# EAGLE design Dual v12 (EAGLE 6.5.0)

## Sheet 1 of 2
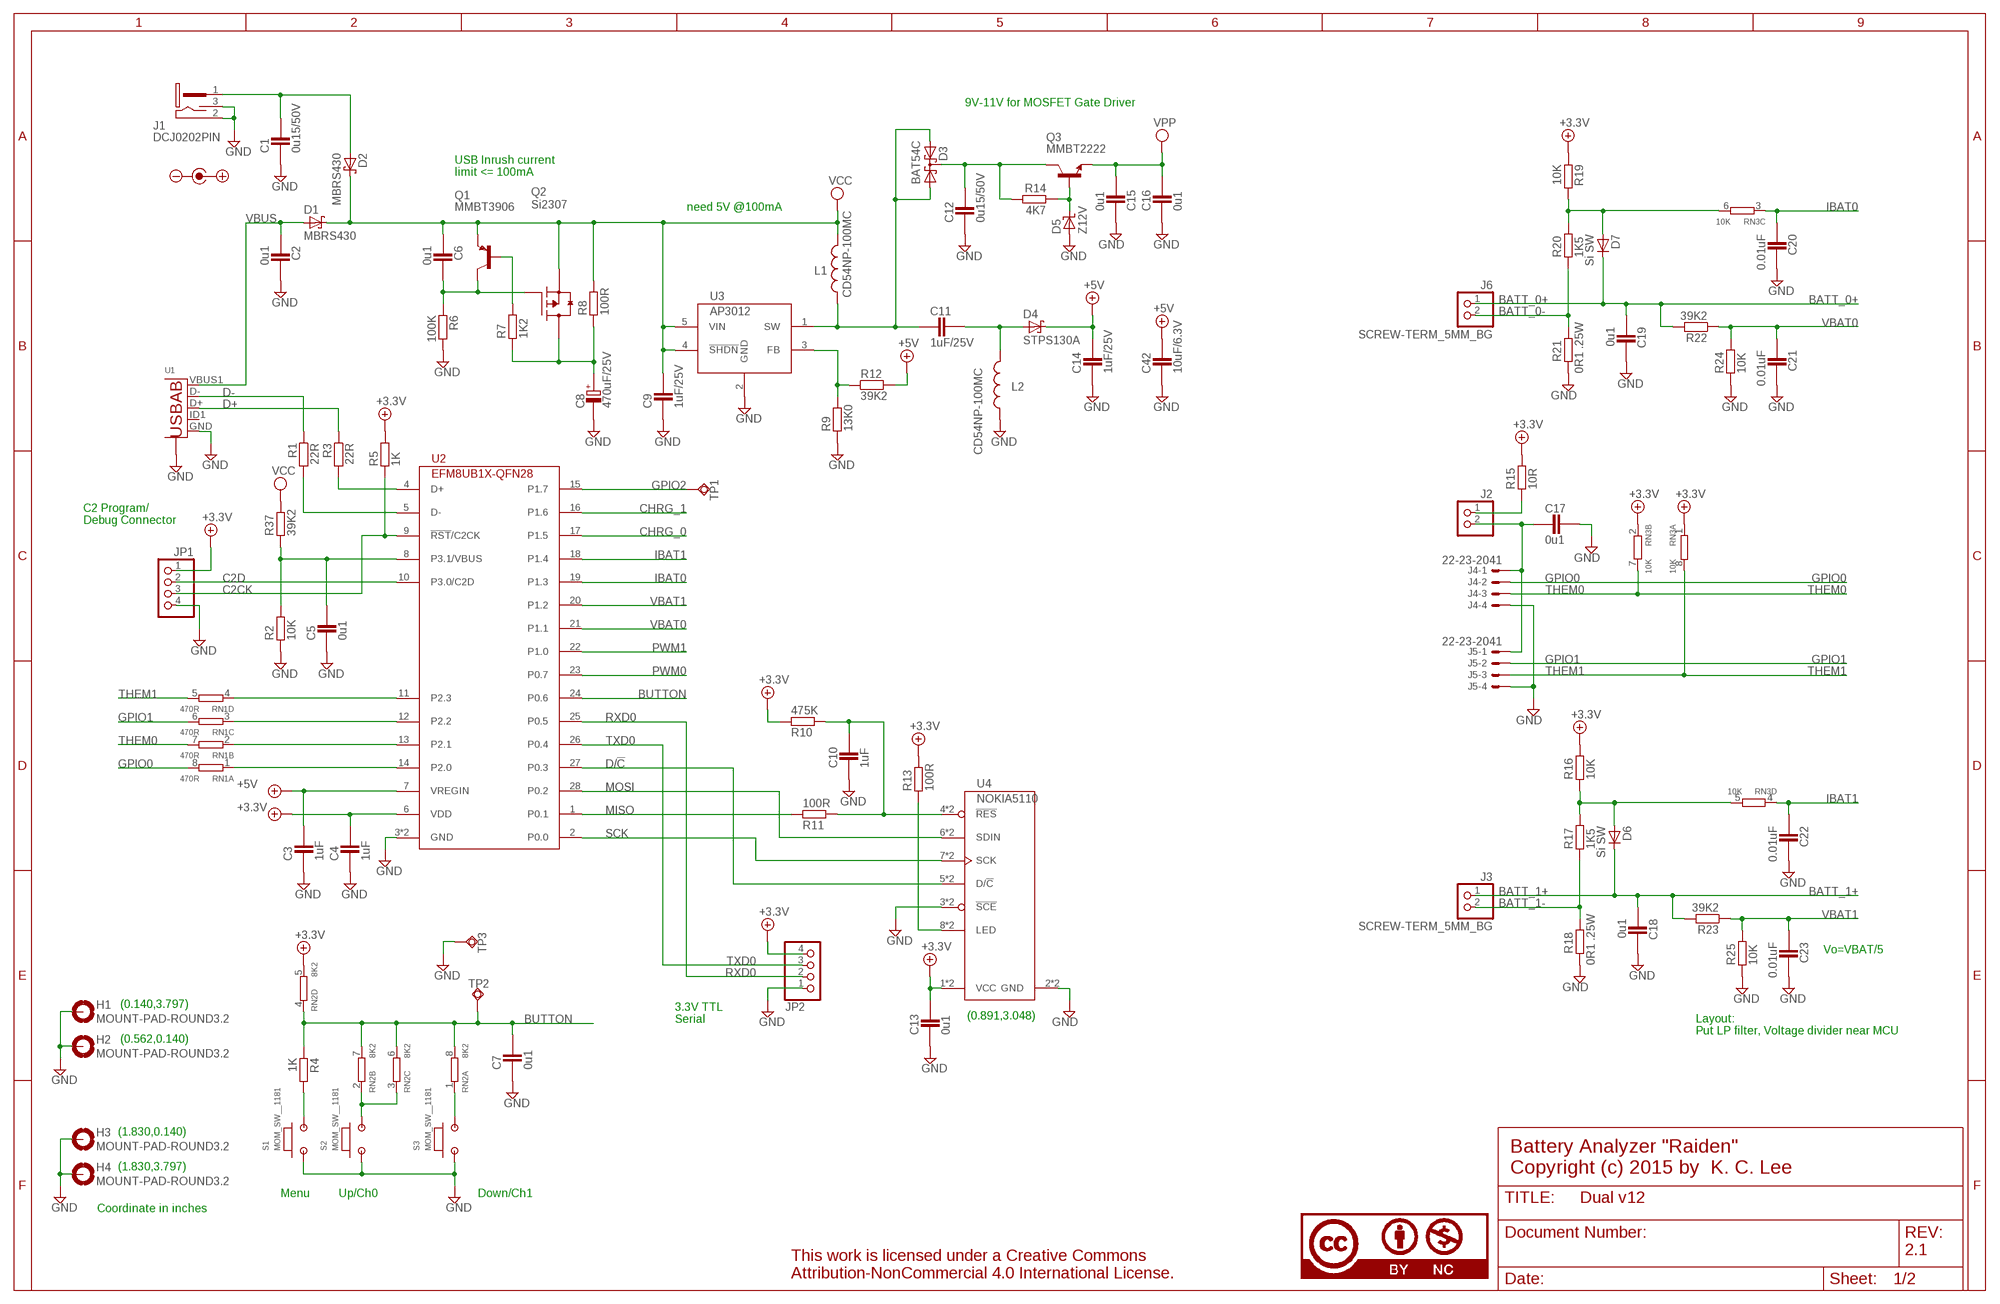
[diagram p0: schematic, sheet 1]

### Parts
C1  0u15/50V  CAPACITOR_0805N  [CAP2012X70N]
C2  0u1  CAPACITOR_0603  [CAPC1608X92N]
C3  1uF  CAPACITOR_0402  [CAPC1005X60N]
C4  1uF  CAPACITOR_0402  [CAPC1005X60N]
C5  0u1  CAPACITOR_0402  [CAPC1005X60N]
C6  0u1  CAPACITOR_0603  [CAPC1608X92N]
C7  0u1  CAPACITOR_0603  [CAPC1608X92N]
C8  470uF/25V  POLARISED_CASE_G  [CAPAE1030X1020N]
C9  1uF/25V  CAPACITOR_0805N  [CAP2012X70N]
C10  1uF  CAPACITOR_0603  [CAPC1608X92N]
C11  1uF/25V  CAPACITOR_0805N  [CAP2012X70N]
C12  0u15/50V  CAPACITOR_0805N  [CAP2012X70N]
C13  0u1  CAPACITOR_0603  [CAPC1608X92N]
C14  1uF/25V  CAPACITOR_0805N  [CAP2012X70N]
C15  0u1  CAPACITOR_0603  [CAPC1608X92N]
C16  0u1  CAPACITOR_0603  [CAPC1608X92N]
C17  0u1  CAPACITOR_0603  [CAPC1608X92N]
C18  0u1  CAPACITOR_0603  [CAPC1608X92N]
C19  0u1  CAPACITOR_0603  [CAPC1608X92N]
C20  0.01uF  CAPACITOR_0603  [CAPC1608X92N]
C21  0.01uF  CAPACITOR_0603  [CAPC1608X92N]
C22  0.01uF  CAPACITOR_0603  [CAPC1608X92N]
C23  0.01uF  CAPACITOR_0603  [CAPC1608X92N]
C42  10uF/6.3V  CAPACITOR_0805N  [CAP2012X70N]
D1  MBRS430  SCHOTTKY_SMC  [DIOM7959X265N]
D2  MBRS430  SCHOTTKY_SMC  [DIOM7959X265N]
D3  BAT54C  [SOT95P280X135-3N]
D4  STPS130A  SCHOTTKY_SMA  [DIOM5326X292N]
D5  Z12V  ZENER_SOT-23  [SOT95P280X135-3N]
D6  Si SW  DIODE_SOT-23  [SOT95P280X135-3N]
D7  Si SW  DIODE_SOT-23  [SOT95P280X135-3N]
H1  MOUNT-PAD-ROUND3.2  [3,2-PAD]
H2  MOUNT-PAD-ROUND3.2  [3,2-PAD]
H3  MOUNT-PAD-ROUND3.2  [3,2-PAD]
H4  MOUNT-PAD-ROUND3.2  [3,2-PAD]
J1  DCJ0202PIN  [PJ-102A]
J2  PINHD-1X2_2.54  [1X02]
J3  SCREW-TERM_5MM_BG  [1X02-5MM-BG]
J4  22-23-2041  [22-23-2041]
J5  22-23-2041  [22-23-2041]
J6  SCREW-TERM_5MM_BG  [1X02-5MM-BG]
JP1  PINHD-1X4_2.54  [1X04]
JP2  PINHD-1X4_2.54-90°  [1X04-RA]
L1  CD54NP-100MC  CD54  [CD54]
L2  CD54NP-100MC  CD54  [CD54]
Q1  MMBT3906  PNP_SOT-23  [SOT95P280X135-3N]
Q2  Si2307  MOSFET-PCH_SOT-23  [SOT95P280X135-3N]
Q3  MMBT2222  NPN_SOT-23  [SOT95P280X135-3N]
R1  22R  RESISTOR_0603  [RESC1608X55N]
R2  10K  RESISTOR_0603  [RESC1608X55N]
R3  22R  RESISTOR_0603  [RESC1608X55N]
R4  1K  RESISTOR_0603  [RESC1608X55N]
R5  1K  RESISTOR_0402  [RESC1005X40AN]
R6  100K  RESISTOR_0603  [RESC1608X55N]
R7  1K2  RESISTOR_0603  [RESC1608X55N]
R8  100R  RESISTOR_0805  [RESC2012X70N]
R9  13K0  RESISTOR_0603  [RESC1608X55N]
R10  475K  RESISTOR_0603  [RESC1608X55N]
R11  100R  RESISTOR_0603  [RESC1608X55N]
R12  39K2  RESISTOR_0603  [RESC1608X55N]
R13  100R  RESISTOR_0603  [RESC1608X55N]
R14  4K7  RESISTOR_0603  [RESC1608X55N]
R15  10R  RESISTOR_0603  [RESC1608X55N]
R16  10K  RESISTOR_0603  [RESC1608X55N]
R17  1K5  RESISTOR_0603  [RESC1608X55N]
R18  0R1 .25W  RESISTOR_1206  [RESC3115X70N]
R19  10K  RESISTOR_0603  [RESC1608X55N]
R20  1K5  RESISTOR_0603  [RESC1608X55N]
R21  0R1 .25W  RESISTOR_1206  [RESC3115X70N]
R22  39K2  RESISTOR_0603  [RESC1608X55N]
R23  39K2  RESISTOR_0603  [RESC1608X55N]
R24  10K  RESISTOR_0603  [RESC1608X55N]
R25  10K  RESISTOR_0603  [RESC1608X55N]
R37  39K2  RESISTOR_0603  [RESC1608X55N]
RN1  470R  4R-NCAT16  [CAT16]
RN2  8K2  4R-NCAT16  [CAT16]
RN3  10K  4R-NCAT16  [CAT16]
S1  MOM_SW__1181  [MOM-1181]
S2  MOM_SW__1181  [MOM-1181]
S3  MOM_SW__1181  [MOM-1181]
TP1  TPSQTP08R  [TP08R]
TP2  TPSQTP14SQ  [TP14SQ]
TP3  TPSQTP14SQ  [TP14SQ]
U1  USB-ABBG  [USB-AB-MICRO-SMD_V03_SF]
U2  EFM8UB1X-QFN28  [QFN-28]
U3  AP3012  [SOT23-5]
U4  NOKIA5110  [NOKIA5110-BOTH]
U$1  CC100%  [CC-100]
U$3  POLARITY  [POLARITY]

### Nets
+3.3V: C4.2 C13.2 JP1.1 JP2.4 R5.2 R10.1 R13.2 R15.2 R16.2 R19.1 RN2.5 RN3.1 RN3.2 U2.6(VDD) U4.1(VCC) U4.9(VCC) ; also sheet 2
+5V: C3.2 C14.2 C42.2 D4.K R12.2 U2.7(VREGIN) ; also sheet 2
BATT_0+: C19.1 D7.3(K) J6.1 R22.2 ; also sheet 2
BATT_0-: J6.2 R20.1 R21.2
BATT_1+: C18.1 D6.3(K) J3.1 R23.2 ; also sheet 2
BATT_1-: J3.2 R17.1 R18.2
BUTTON: C7.2 R4.1 RN2.4 RN2.6 RN2.7 RN2.8 TP2.TP U2.24(P0.6)
C2CK: JP1.3 R5.1 U2.9(!RST!/C2CK)
C2D: JP1.2 U2.10(P3.0/C2D)
CHRG_0: U2.17(P1.5) ; also sheet 2
CHRG_1: U2.16(P1.6) ; also sheet 2
D+: R3.1 U1.D+
D-: R1.1 U1.D-
D/!C: U2.27(P0.3) U4.5(D/!C) U4.13(D/!C)
GND: C1.1 C2.2 C3.1 C4.1 C5.1 C7.1 C8.- C9.1 C10.1 C12.1 C13.1 C14.1 C15.1 C16.1 C17.2 C18.2 C19.2 C20.2 C21.2 C22.2 C23.2 C42.1 D5.1(A) H1.B3,2(MOUNT) H2.B3,2(MOUNT) H3.B3,2(MOUNT) H4.B3,2(MOUNT) J1.2 J1.3 J4.4 J5.4 JP1.4 JP2.1 L2.1 R2.1 R6.2 R9.1 R18.1 R21.1 R24.1 R25.1 S1.1 S2.1 S3.1 TP3.TP U1.GND U1.S1(S) U1.S2(S) U1.S3(S) U1.S4(S) U2.3(GND) U2.PAD(GND) U3.2(GND) U4.2(GND) U4.3(!SCE) U4.10(GND) U4.11(!SCE) ; also sheet 2
GPIO0: J4.2 RN1.8
GPIO1: J5.2 RN1.6
GPIO2: TP1.TP U2.15(P1.7)
IBAT0: C20.1 RN3.3 U2.19(P1.3)
IBAT1: C22.1 RN3.4 U2.18(P1.4)
MISO: R11.1 U2.1(P0.1)
MOSI: U2.28(P0.2) U4.6(SDIN) U4.14(SDIN)
N$1: C6.2 Q1.3(C) Q2.1(G) R6.1
N$2: C10.2 R10.2 R11.2 U4.4(!RES) U4.12(!RES)
N$7: Q1.1(B) R7.2
N$12: R13.1 U4.8(LED) U4.16(LED)
N$16: RN1.1 U2.14(P2.0)
N$17: C1.2 D2.A J1.1
N$19: D5.3(K) Q3.1(B) R14.1
N$20: C11.1 D3.1(A1) D3.2(A2) L1.1 U3.1(SW)
N$22: C8.+ Q2.3(D) R7.1 R8.1
N$23: C11.2 D4.A L2.2
N$24: R3.2 U2.4(D+)
N$25: C12.2 D3.3(CC) Q3.3(C) R14.2
N$26: R9.2 R12.1 U3.3(FB)
N$27: C5.2 R2.2 R37.1 U2.8(P3.1/VBUS)
N$28: R1.2 U2.5(D-)
N$29: RN1.2 U2.13(P2.1)
N$30: R4.2 S1.2
N$31: RN1.3 U2.12(P2.2)
N$32: RN1.4 U2.11(P2.3)
N$33: C17.1 J2.2 J4.1 J5.1
N$34: RN2.2 RN2.3 S2.2
N$35: J2.1 R15.1
N$39: RN2.1 S3.2
N$100: D6.1(A) R16.1 R17.2 RN3.5
N$101: D7.1(A) R19.2 R20.2 RN3.6
PWM0: U2.23(P0.7) ; also sheet 2
PWM1: U2.22(P1.0) ; also sheet 2
RXD0: JP2.2 U2.25(P0.5)
SCK: U2.2(P0.0) U4.7(SCK) U4.15(SCK)
THEM0: J4.3 RN1.7 RN3.7
THEM1: J5.3 RN1.5 RN3.8
TXD0: JP2.3 U2.26(P0.4)
VBAT0: C21.1 R22.1 R24.2 U2.21(P1.1)
VBAT1: C23.1 R23.1 R25.2 U2.20(P1.2)
VBUS: C2.1 D1.A U1.VBUS1(VBUS)
VCC: C6.1 C9.2 D1.K D2.K L1.2 Q1.2(E) Q2.2(S) R8.2 R37.2 U3.4(!SHDN) U3.5(VIN) ; also sheet 2
VPP: C15.2 C16.2 Q3.2(E) ; also sheet 2
Unconnected: U1.ID1(USBID)

### Notes on the sheet
- 9V-11V for MOSFET Gate Driver
- USB Inrush current 
  limit <= 100mA
- need 5V @100mA
- C2 Program/
  Debug Connector
- Vo=VBAT/5
- (0.140,3.797)
- (0.891,3.048)
- 3.3V TTL
  Serial
- Layout: 
  Put LP filter, Voltage divider near MCU
- (0.562,0.140)
- (1.830,0.140)
- (1.830,3.797)
- Battery Analyzer "Raiden"
  Copyright (c) 2015 by  K. C. Lee
- Menu | Up/Ch0 | Down/Ch1
- Coordinate in inches
- 2.1

## Sheet 2 of 2
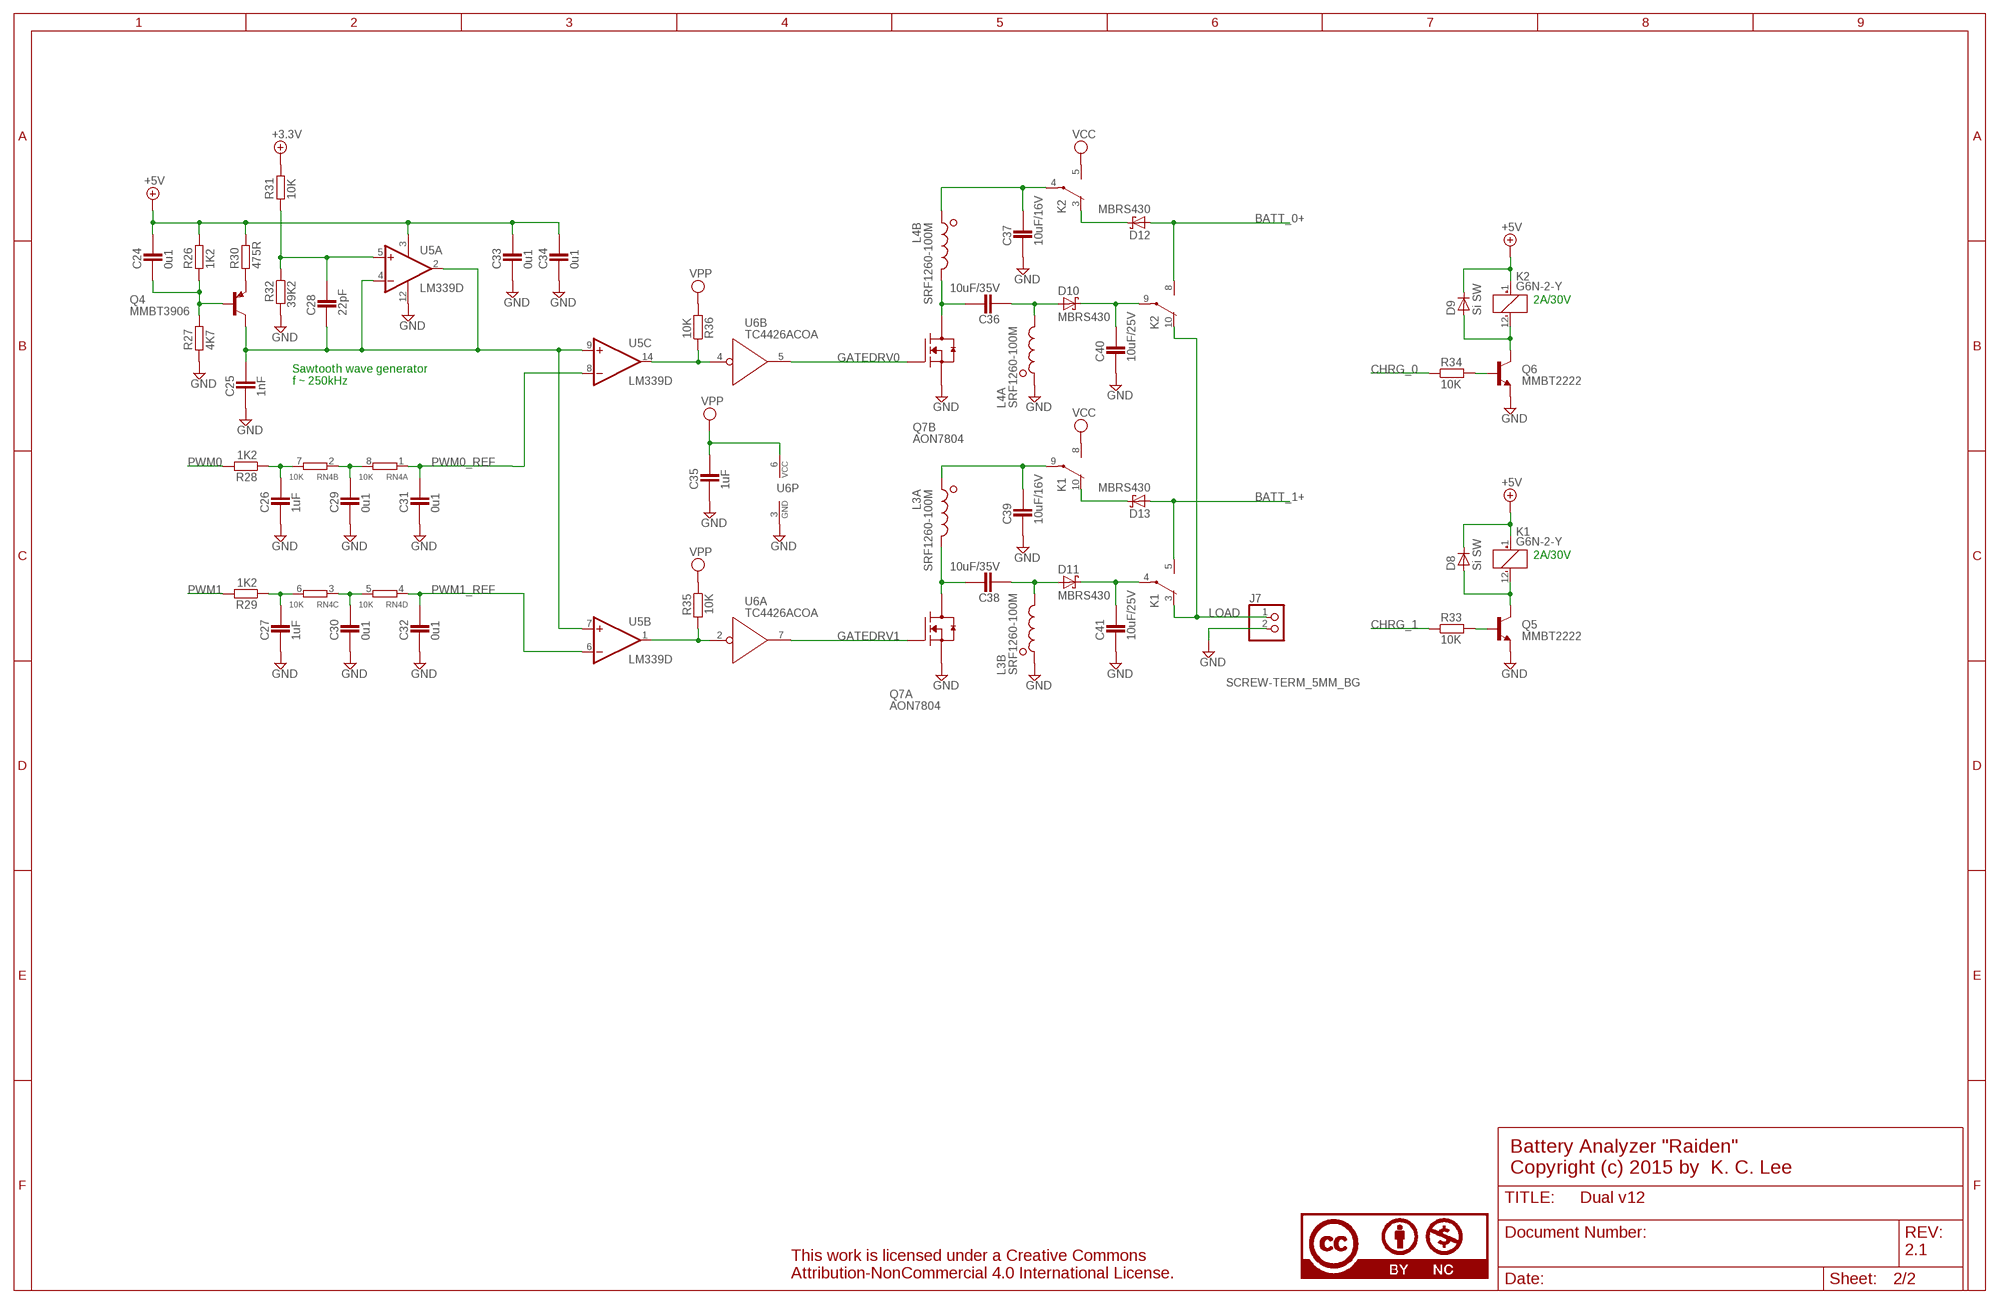
[diagram p1: schematic, sheet 2]

### Parts
C24  0u1  CAPACITOR_0603  [CAPC1608X92N]
C25  1nF  CAPACITOR_0603  [CAPC1608X92N]
C26  1uF  CAPACITOR_0603  [CAPC1608X92N]
C27  1uF  CAPACITOR_0603  [CAPC1608X92N]
C28  22pF  CAPACITOR_0603  [CAPC1608X92N]
C29  0u1  CAPACITOR_0402  [CAPC1005X60N]
C30  0u1  CAPACITOR_0402  [CAPC1005X60N]
C31  0u1  CAPACITOR_0402  [CAPC1005X60N]
C32  0u1  CAPACITOR_0402  [CAPC1005X60N]
C33  0u1  CAPACITOR_0603  [CAPC1608X92N]
C34  0u1  CAPACITOR_0603  [CAPC1608X92N]
C35  1uF  CAPACITOR_0603  [CAPC1608X92N]
C36  10uF/35V  CAPACITOR_1206  [CAPC3215X168N]
C37  10uF/16V  CAPACITOR_1206  [CAPC3215X168N]
C38  10uF/35V  CAPACITOR_1206  [CAPC3215X168N]
C39  10uF/16V  CAPACITOR_1206  [CAPC3215X168N]
C40  10uF/25V  CAPACITOR_1206  [CAPC3215X168N]
C41  10uF/25V  CAPACITOR_1206  [CAPC3215X168N]
D8  Si SW  DIODE_SOT-23  [SOT95P280X135-3N]
D9  Si SW  DIODE_SOT-23  [SOT95P280X135-3N]
D10  MBRS430  SCHOTTKY_SMC  [DIOM7959X265N]
D11  MBRS430  SCHOTTKY_SMC  [DIOM7959X265N]
D12  MBRS430  SCHOTTKY_SMC  [DIOM7959X265N]
D13  MBRS430  SCHOTTKY_SMC  [DIOM7959X265N]
J7  SCREW-TERM_5MM_BG  [1X02-5MM-BG]
K1  G6N-2-Y  NA  [NA]
K2  G6N-2-Y  NA  [NA]
L3  SRF1260-100M  SRF1260  [SRF1260]
L4  SRF1260-100M  SRF1260  [SRF1260]
Q4  MMBT3906  PNP_SOT-23  [SOT95P280X135-3N]
Q5  MMBT2222  NPN_SOT-23  [SOT95P280X135-3N]
Q6  MMBT2222  NPN_SOT-23  [SOT95P280X135-3N]
Q7  AON7804  [DFN3X3]
R26  1K2  RESISTOR_0603  [RESC1608X55N]
R27  4K7  RESISTOR_0603  [RESC1608X55N]
R28  1K2  RESISTOR_0603  [RESC1608X55N]
R29  1K2  RESISTOR_0603  [RESC1608X55N]
R30  475R  RESISTOR_0603  [RESC1608X55N]
R31  10K  RESISTOR_0603  [RESC1608X55N]
R32  39K2  RESISTOR_0603  [RESC1608X55N]
R33  10K  RESISTOR_0603  [RESC1608X55N]
R34  10K  RESISTOR_0603  [RESC1608X55N]
R35  10K  RESISTOR_0603  [RESC1608X55N]
R36  10K  RESISTOR_0603  [RESC1608X55N]
RN4  10K  4R-NCAT16  [CAT16]
U5  LM339D  [SO14]
U6  TC4426ACOA  TC4426AMF  [SOIC8]
U$2  CCNONE  [CC-NONE]

### Nets
+3.3V: R31.2 ; also sheet 1
+5V: C24.2 C33.2 C34.2 D8.3(K) D9.3(K) K1.1(1:+) K2.1(1:+) R26.2 R30.2 U5.3(P:V+) ; also sheet 1
BATT_0+: D12.A K2.8(3:S) ; also sheet 1
BATT_1+: D13.A K1.5(2:S) ; also sheet 1
CHRG_0: R34.1 ; also sheet 1
CHRG_1: R33.1 ; also sheet 1
GATEDRV0: Q7.G2(B:G) U6.5(B:OUT)
GATEDRV1: Q7.G1(A:G) U6.7(A:OUT)
GND: C25.1 C26.1 C27.1 C29.1 C30.1 C31.1 C32.1 C33.1 C34.1 C35.1 C37.1 C39.1 C40.1 C41.1 J7.2 L3.2 L4.1 Q5.2(E) Q6.2(E) Q7.S1(A:S) Q7.S2(B:S) R27.1 R32.2 U5.12(P:GND) U6.3(P:GND) ; also sheet 1
LOAD: J7.1 K1.3(2:O) K2.10(3:O)
N$3: D8.1(A) K1.12(1:-) Q5.3(C)
N$4: D13.K K1.10(3:O)
N$5: D9.1(A) K2.12(1:-) Q6.3(C)
N$6: C28.2 R31.1 R32.1 U5.5(A:+IN)
N$8: Q6.1(B) R34.2
N$9: Q5.1(B) R33.2
N$10: D12.K K2.3(2:O)
N$11: C30.2 RN4.3 RN4.5
N$13: C26.2 R28.1 RN4.7
N$14: C27.2 R29.1 RN4.6
N$15: C29.2 RN4.2 RN4.8
N$18: C38.2 L3.3 Q7.D1@1(A:D) Q7.D1@2(A:D)
N$56: C24.1 Q4.1(B) R26.1 R27.2
N$57: Q4.2(E) R30.1
N$60: C25.2 C28.1 Q4.3(C) U5.2(A:OUT) U5.4(A:-IN) U5.7(B:+IN) U5.9(C:+IN)
N$61: C36.2 L4.4 Q7.D2@1(B:D) Q7.D2@2(B:D)
N$63: C38.1 D11.A L3.4
N$64: C36.1 D10.A L4.3
N$67: C37.2 K2.4(2:P) L4.2
N$68: C40.2 D10.K K2.9(3:P)
N$69: C41.2 D11.K K1.4(2:P)
N$70: C39.2 K1.9(3:P) L3.1
PWM0: R28.2 ; also sheet 1
PWM0_OUT: R35.2 U5.1(B:OUT) U6.2(A:!IN)
PWM0_REF: C31.2 RN4.1 U5.8(C:-IN)
PWM1: R29.2 ; also sheet 1
PWM1_OUT: R36.1 U5.14(C:OUT) U6.4(B:!IN)
PWM1_REF: C32.2 RN4.4 U5.6(B:-IN)
VCC: K1.8(3:S) K2.5(2:S) ; also sheet 1
VPP: C35.2 R35.1 R36.2 U6.6(P:VCC) ; also sheet 1
Unconnected: U5.10(D:-IN) U5.11(D:+IN) U5.13(D:OUT)

### Notes on the sheet
- 2A/30V
- Sawtooth wave generator
  f ~ 250kHz
- 2A/30V
- Battery Analyzer "Raiden"
  Copyright (c) 2015 by  K. C. Lee
- 2.1

## Library data of the parts
C1 C12 = ipc-7351-capacitor:CAPACITOR_; PARTNO: STOCK: 0.15UF/50V10%
C2 C6 C7 C13 C15-C19 C24 C33 C34 = ipc-7351-capacitor:CAPACITOR_; PARTNO: STOCK: DK 490-1532-1-ND
C3 C4 = ipc-7351-capacitor:CAPACITOR_; PARTNO: DK: 490-10435-1-ND
C5 C29-C32 = ipc-7351-capacitor:CAPACITOR_; PARTNO: STOCK: DK 587-1227-1-ND
C8 = ipc-7351-capacitor:POLARISED_; PARTNO: STOCK
C9 C11 C14 = ipc-7351-capacitor:CAPACITOR_; PARTNO: DK: 311-1456-1-ND
C10 C26 C27 C35 = ipc-7351-capacitor:CAPACITOR_; PARTNO: STOCK: 1UF/10V 20% TDK
C20-C23 = ipc-7351-capacitor:CAPACITOR_; PARTNO: DK: 311-1085-1-ND
C25 = ipc-7351-capacitor:CAPACITOR_; PARTNO: DK: 311-1080-1-ND
C28 = ipc-7351-capacitor:CAPACITOR_; PARTNO: STOCK: 22PF
C36 C38 = ipc-7351-capacitor:CAPACITOR_; PARTNO: DK: 490-9964-1-ND
C37 C39-C42 = ipc-7351-capacitor:CAPACITOR_; PARTNO: DK: 490-5525-1-ND
D1 D2 D10-D13 = ipc-7351-diode:SCHOTTKY_; PARTNO: STOCK
D3 = misc semi:BAT54C: Schottky Diodes Source: Fairchild .. BAT54.pdf; PARTNO: STOCK
D4 = ipc-7351-diode:SCHOTTKY_; PARTNO: DK: 497-3755-1-ND
D5 = ipc-7351-diode:ZENER_; PARTNO: STOCK
D6-D9 = ipc-7351-diode:DIODE_; PARTNO: STOCK: BAV99
H1-H4 = holes:MOUNT-PAD-ROUND: MOUNTING PAD, round; PARTNO: *
J1 = Misc Conn:DCJ0202: DC POWER JACK Source: DCJ0202.pdf Pin = CUI Inc. PJ-102A with formed pins; PARTNO: STOCK: DK CP-102A-ND
J2 = Misc Conn:PINHD-1X2: PIN HEADER; PARTNO: BG: SKU038984
J3 J6 J7 = Misc Conn:SCREW-TERM: Screw Terminal: 3.5mm: On-Shore Technology OSTTE0201x4; PARTNO: BG: SKU170379
J4 J5 = Misc Conn:22-23-2041: .100" (2.54mm) Center Header - 4 Pin; MF: MOLEX; MPN: 22-23-2041; OC_FARNELL: 1462920; OC_NEWARK: 38C0355; PARTNO: DK: A19431-ND
JP1 = Misc Conn:PINHD-1X4: PIN HEADER; PARTNO: BG: SKU038984
JP2 = Misc Conn:PINHD-1X4: PIN HEADER; PARTNO: STOCK
K1 K2 = Misc Power:NA: RELAY; OC_FARNELL: unknown; OC_NEWARK: unknown; PARTNO: STOCK
L1 L2 = Misc Inductors:CD; PARTNO: DK: 587-1626-1-ND
L3 L4 = Misc Inductors:SRF1260; PARTNO: DK: SRF1260-100MCT-ND
Q1 Q4 = ipc-7351-transistor:PNP_; PARTNO: STOCK:MMBT3906
Q2 = ipc-7351-transistor:MOSFET-PCH_; PARTNO: STOCK: SI2307DS
Q3 Q5 Q6 = ipc-7351-transistor:NPN_; PARTNO: STOCK: MMBT2222
Q7 = misc-transistor:AON7804; PARTNO: DK: 785-1586-1-ND
R1 R3 = ipc-7351-resistor:RESISTOR_; PARTNO: STOCK: DK 1276-3497-1-ND
R2 R16 R19 R24 R25 R31 R33-R36 = ipc-7351-resistor:RESISTOR_; PARTNO: STOCK: 10K 1%
R4 = ipc-7351-resistor:RESISTOR_; PARTNO: STOCK: DK 1276-3484-1-ND
R5 = ipc-7351-resistor:RESISTOR_; PARTNO: DK: 311-1.00KLRCT-ND
R6 = ipc-7351-resistor:RESISTOR_; PARTNO: STOCK: DK311-100KHRCT-ND
R7 R26 R28 R29 = ipc-7351-resistor:RESISTOR_; PARTNO: STOCK: 1K21 1%
R8 R11 R13 = ipc-7351-resistor:RESISTOR_; PARTNO: STOCK
R9 = ipc-7351-resistor:RESISTOR_; PARTNO: DK: 311-13.0KHRCT-ND
R10 = ipc-7351-resistor:RESISTOR_; PARTNO: STOCK: P475KHCT-ND
R12 R22 R23 R32 R37 = ipc-7351-resistor:RESISTOR_; PARTNO: DK: 311-39.2KHRCT-ND
R14 R27 = ipc-7351-resistor:RESISTOR_; PARTNO: STOCK:4K75 1%
R15 = ipc-7351-resistor:RESISTOR_; PARTNO: STOCK: 10R 1%
R17 R20 = ipc-7351-resistor:RESISTOR_; PARTNO: STOCK: DKRHM1.50KCFCT-ND
R18 R21 = ipc-7351-resistor:RESISTOR_; PARTNO: STOCK: DK73L4R10JCT-ND
R30 = ipc-7351-resistor:RESISTOR_; PARTNO: STOCK: DK 1276-4620-1-ND
RN1 = Misc Passives:4R-N: Array Chip Resistor Source: RS Component / Phycomp; OC_FARNELL: unknown; OC_NEWARK: unknown; PARTNO: DK: YC164J-470CT-ND
RN2 = Misc Passives:4R-N: Array Chip Resistor Source: RS Component / Phycomp; OC_FARNELL: unknown; OC_NEWARK: unknown; PARTNO: STOCK
RN3 RN4 = Misc Passives:4R-N: Array Chip Resistor Source: RS Component / Phycomp; OC_FARNELL: unknown; OC_NEWARK: unknown; PARTNO: STOCK: DK CAY16-103J4GLFCT-ND
S1-S3 = Misc Passives:MOM_SW__: Chinese "1181" tactile switch, C&K KMT0 Tactile Switch; PARTNO: BG: SKU156899
TP1-TP3 = testpad:TPSQ: Test pad; PARTNO: *
U1 = Misc Conn:USB-AB: This is a USB AB connector that is compatible with USB OTG. i.e. this connector can serve as a host or device; PARTNO: DX: SKU134132
U2 = Misc Processor:EFM8UB1X-QFN28; PARTNO: DK: 336-3183-5-ND
U3 = Misc Power:AP3012; PARTNO: DK: AP3012KTR-G1DICT-ND
U4 = Misc opto:NOKIA5110: DX Nokia 5110 LCD 84x48; PARTNO: BG: SKU091069
U5 = linear:LM339: Low Power Low Offset Voltage Quad Comparators with open collector; LM139/LM239/LM339/LM2901/LM3302; PARTNO: STOCK
U6 = Misc Power:TC4426A; PARTNO: DK: TC4426ACOA-ND
U$1 U$2 = Misc logo:CC; PARTNO: *
U$3 = Misc logo:POLARITY; PARTNO: *

## Board
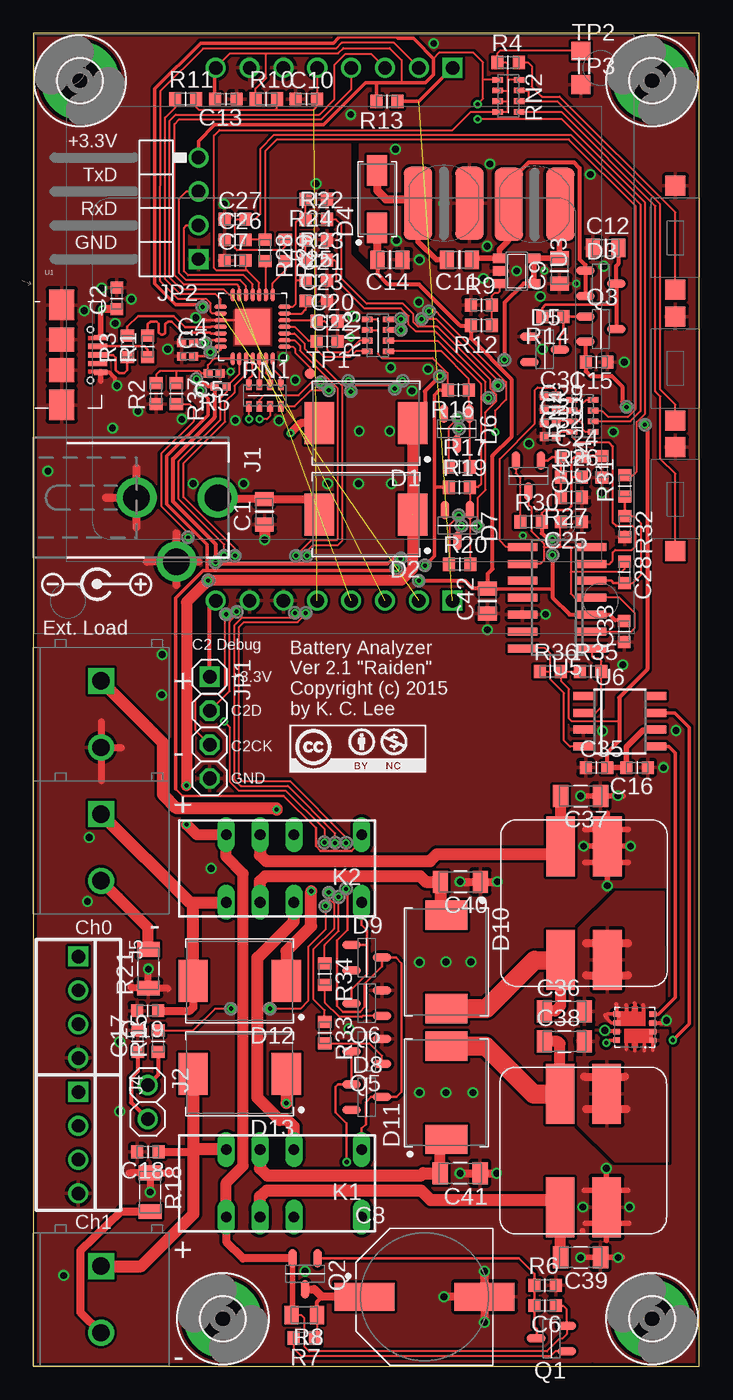
[diagram p2: board, top side]
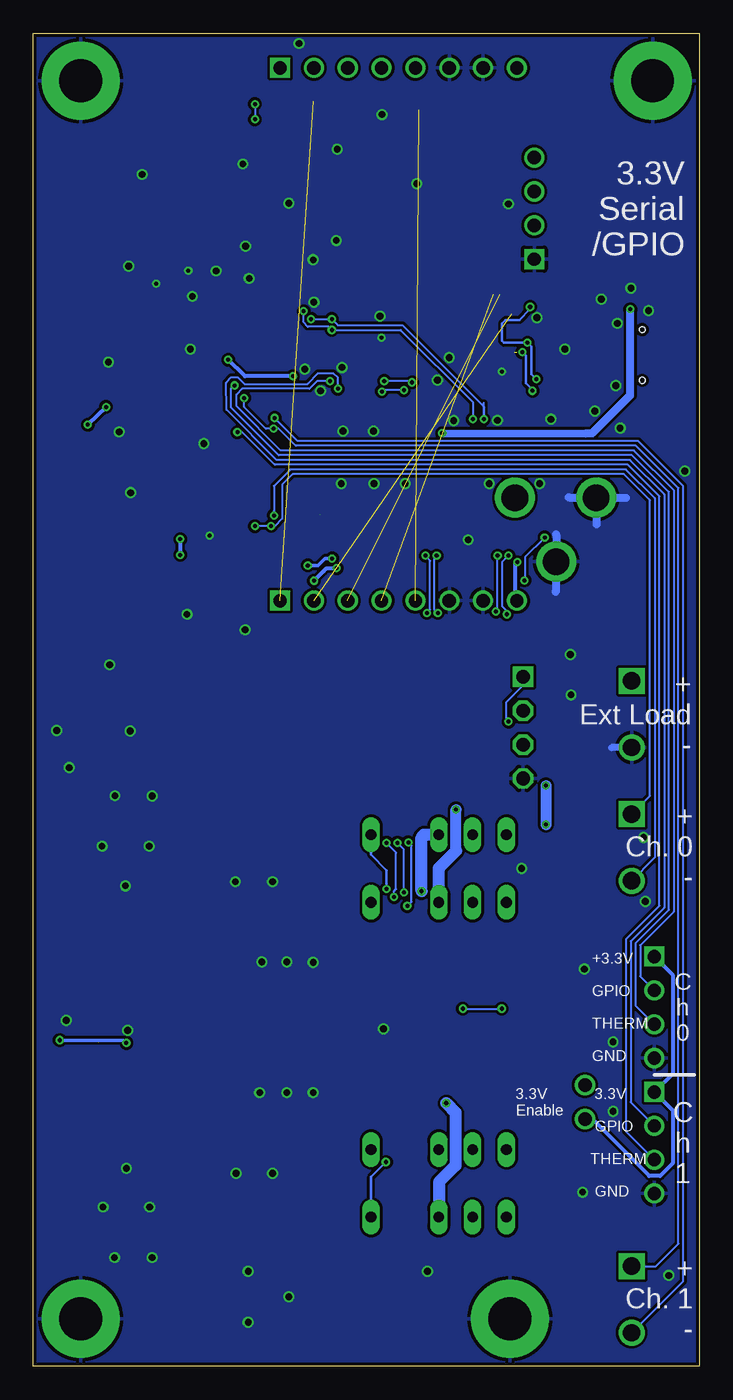
[diagram p3: board, bottom side, seen from below]

Size 49.99 x 100 mm. Coordinates in mm from the lower left corner, seen from the top.
Outline: 49.99,100 0,100 0,0 41.99,0 49.99,0 49.99,100
Copper layers (1*16): Top 0.035mm / dielectric 1.5mm / Bottom 0.035mm
Design rules "Elecrow 2-layer eagle rule": minimum track width 6mil, minimum drill 12mil, track to track 6mil, track to pad 6mil, pad to pad 6mil, via to via 6mil, smd to smd 0mil, copper to edge 10mil, drill to drill 10mil, minimum pad ring 10mil, minimum via ring 6mil, stop-mask expansion 2mil, vias tented up to drill 100mil, thermal gap 10mil
tRestrict: 2 lines

### Footprints (pad centres in the part's own frame; a part is rotated, then mirrored left to right if it is on the bottom)
CAP2012X70N = smd 1.05 x 1.4: 1 -0.95,0; 2 0.95,0
CAPC1608X92N = smd 0.9 x 0.95: 1 -0.8,0; 2 0.8,0
CAPC1005X60N = smd 0.65 x 0.65: 1 -0.45,0; 2 0.45,0
CAPAE1030X1020N = smd 4.5 x 2.1: + -4.5,0; - 4.5,0
CAPC3215X168N = smd 1.15 x 1.65: 1 -1.5,0; 2 1.5,0
DIOM7959X265N = smd 2.2 x 3.15: A 3.5,0; K -3.5,0
SOT95P280X135-3N = smd 1.4 x 0.65: 1 -1.15,0.95; 2 -1.15,-0.95; 3 1.15,0
DIOM5326X292N = smd 2.3 x 1.5: A 2.15,0; K -2.15,0
3,2-PAD = drill 3.2 pad 5.842: B3,2 0,0
PJ-102A = drill 2: 1 0,3.1; 2 0,-3; 3 4.8,0
1X02 = drill 1.016: 1 -1.27,0; 2 1.27,0
1X02-5MM-BG = drill 1.3 square: 1 -2.5,0 | drill 1.3: 2 2.5,0
22-23-2041 = drill 1 square: 1 -3.81,0 | drill 1: 2 -1.27,0; 3 1.27,0; 4 3.81,0
1X04 = drill 1.016 square: 1 -3.81,0 | drill 1.016 octagon: 2 -1.27,0; 3 1.27,0; 4 3.81,0
1X04-RA = drill 1 square: 1 -3.81,0 | drill 1: 2 -1.27,0; 3 1.27,0; 4 3.81,0
NA = drill 0.8 long: 1 -6.35,-2.54; 3 -1.27,-2.54; 4 1.27,-2.54; 5 3.81,-2.54; 8 3.81,2.54; 9 1.27,2.54; 10 -1.27,2.54; 12 -6.35,2.54
CD54 = smd 5.5 x 2.15: 1 0,1.925; 2 0,-1.925
SRF1260 = smd 2.15 x 4.5: 1 1.75,4.25; 2 -1.75,4.25; 3 -1.75,-4.25; 4 1.75,-4.25
DFN3X3 = smd 0.4 x 0.508: D1@1 -0.98,-1.36; D1@2 -0.325,-1.36; D2@1 0.325,1.36; D2@2 0.98,1.36; G1 -0.975,1.36; G2 0.975,-1.36; S1 -0.32,1.36; S2 0.32,-1.36
RESC1608X55N = smd 0.9 x 1: 1 -0.8,0; 2 0.8,0
RESC1005X40AN = smd 0.6 x 0.6: 1 -0.45,0; 2 0.45,0
RESC2012X70N = smd 1.05 x 1.4: 1 -0.95,0; 2 0.95,0
RESC3115X70N = smd 1.1 x 1.7: 1 -1.45,0; 2 1.45,0
CAT16 = smd 0.425 x 0.8: 1 -1.2,-0.8; 2 -0.4,-0.8; 3 0.4,-0.8; 4 1.2,-0.8; 5 1.2,0.8; 6 0.4,0.8; 7 -0.4,0.8; 8 -1.2,0.8
MOM-1181 = smd 1.5 x 1.5: 1 3.9,0; 2 -3.9,0
TP08R = smd 0.8 x 0.8: TP 0,0
TP14SQ = smd 1.4 x 1.4: TP 0,0
USB-AB-MICRO-SMD_V03_SF = smd 1.4 x 0.4: D+ 2.7,0; D- 2.7,0.65; ID1 2.7,-0.65 | smd 0.975 x 0.4: GND 2.913,-1.3; VBUS1 2.913,1.3 | smd 1.9 x 2.3: S1 0,3.75; S4 0,-3.75 | smd 1.9 x 1.8: S2 0,1.15; S3 0,-1.15 | hole 0.45: 2.15,1.9; 2.15,-1.9
QFN-28 = smd 0.95 x 0.3: 1 -2.4,1.5; 2 -2.4,1; 3 -2.4,0.5; 4 -2.4,0; 5 -2.4,-0.5; 6 -2.4,-1; 7 -2.4,-1.5; 15 2.4,-1.5; 16 2.4,-1; 17 2.4,-0.5; 18 2.4,0; 19 2.4,0.5; 20 2.4,1; 21 2.4,1.5 | smd 0.3 x 0.95: 8 -1.5,-2.4; 9 -1,-2.4; 10 -0.5,-2.4; 11 0,-2.4; 12 0.5,-2.4; 13 1,-2.4; 14 1.5,-2.4; 22 1.5,2.4; 23 1,2.4; 24 0.5,2.4; 25 0,2.4; 26 -0.5,2.4; 27 -1,2.4; 28 -1.5,2.4 | smd 2.65 x 2.65: PAD 0,0
SOT23-5 = smd 0.69 x 0.99: 1 -0.95,-1.29; 2 0,-1.29; 3 0.95,-1.29; 4 0.95,1.3; 5 -0.95,1.3
NOKIA5110-BOTH = drill 1: 1 -8.89,-19.99; 2 -6.35,-19.99; 3 -3.81,-19.99; 4 -1.27,-19.99; 5 1.27,-19.99; 6 3.81,-19.99; 7 6.35,-19.99; 9 -8.89,19.99; 10 -6.35,19.99; 11 -3.81,19.99; 12 -1.27,19.99; 13 1.27,19.99; 14 3.81,19.99; 15 6.35,19.99 | drill 1 square: 8 8.89,-19.99; 16 8.89,19.99
SO14 = smd 0.6 x 2.2: 1 -3.81,-2.6; 2 -2.54,-2.6; 3 -1.27,-2.6; 4 0,-2.6; 5 1.27,-2.6; 6 2.54,-2.6; 7 3.81,-2.6; 8 3.81,2.6; 9 2.54,2.6; 10 1.27,2.6; 11 0,2.6; 12 -1.27,2.6; 13 -2.54,2.6; 14 -3.81,2.6
SOIC8 = smd 0.6 x 1.5: 1 -1.905,-2.75; 2 -0.635,-2.75; 3 0.635,-2.75; 4 1.905,-2.75; 5 1.905,2.75; 6 0.635,2.75; 7 -0.635,2.75; 8 -1.905,2.75

### Placement (x,y rotation side)
C1  17.35,64.11 90 top
C2  6.27,80.11 90 top
C3  11.58,75.77 0 top
C4  11.58,76.78 0 top
C5  13.56,74.5 180 top
C6  38.4,4.55 180 top
C7  15.14,82.96 0 top
C8  29.36,5.21 0 top
C9  39.5,82.17 90 top
C10  20.5,95.07 0 top
C11  31.98,83.01 180 top
C12  42.95,83.9 0 top
C13  14.45,95.07 180 top
C14  26.77,83.01 180 top
C15  42.27,75.34 180 top
C16  45.31,44.91 180 top
C17  7.85,24.38 90 top
C18  8.61,16.08 180 top
C19  8.59,26.67 180 top
C20  22.05,78.41 0 top
C21  21.23,81.46 0 top
C22  22.05,76.89 0 top
C23  21.23,79.93 0 top
C24  40.39,68.22 0 top
C25  40.39,63.35 180 top
C26  15.14,84.51 0 top
C27  15.14,86.06 0 top
C28  44.37,59.56 270 top
C29  38.79,71.78 0 top
C30  38.79,70.76 0 top
C31  38.79,72.8 0 top
C32  38.79,69.75 0 top
C33  44.35,55.12 90 top
C34  42.67,67.46 90 top
C35  42.27,44.91 0 top
C36  39.85,26.62 0 top
C37  41.07,42.77 180 top
C38  39.85,24.36 0 top
C39  41.07,8.15 180 top
C40  32.05,36.35 180 top
C41  32.03,14.48 180 top
C42  34.09,57.4 90 top
D1  24.97,70.74 180 top
D2  24.97,63.88 180 top
D3  42.6,81.23 0 top
D4  25.81,87.55 90 top
D5  38.38,76.28 0 top
D6  31.78,70.33 270 top
D7  31.83,63.07 270 top
D8  25.02,20.19 0 top
D9  25.02,30.66 0 top
D10  30.99,30.33 270 top
D11  30.99,20.52 90 top
D12  15.49,28.91 180 top
D13  15.49,21.95 180 top
H1  3.51,96.44 90 top
H2  14.22,3.56 90 top
H3  46.43,3.56 90 top
H4  46.43,96.44 90 top
J1  10.74,65.15 270 top
J2  8.59,19.81 270 top
J3  5.08,5.01 270 top
J4  3.38,16.76 270 top
J5  3.38,26.92 270 top
J6  5.08,38.92 270 top
J7  5.08,48.92 270 top
JP1  13.23,47.9 270 top
JP2  12.4,86.87 90 top
K1  18.29,13.72 180 top
K2  18.29,37.34 180 top
L1  37.62,87.17 90 top
L2  30.81,87.25 270 top
L3  41.27,16.18 180 top
L4  41.33,34.75 0 top
Q1  38.89,2.08 180 top
Q2  20.4,6.93 270 top
Q3  42.6,77.8 0 top
Q4  37.16,66.78 270 top
Q5  25.02,23.62 180 top
Q6  25.02,27.23 180 top
Q7  45.14,25.43 90 top
R1  8.59,76.51 90 top
R2  9.22,72.97 90 top
R3  7.06,76.51 90 top
R4  35.64,97.82 0 top
R5  14.05,73.48 180 top
R6  38.4,6.07 0 top
R7  20.35,2.11 180 top
R8  20.35,3.84 180 top
R9  33.63,79.6 0 top
R10  17.48,95.07 0 top
R11  11.43,95.07 0 top
R12  33.63,78.08 180 top
R13  26.54,94.89 180 top
R14  38.99,78.74 180 top
R15  9.37,24.38 90 top
R16  31.9,73.23 180 top
R17  31.98,67.46 0 top
R18  8.76,13.06 270 top
R19  31.98,65.94 0 top
R20  32,60.17 0 top
R21  8.64,29.82 90 top
R22  21.23,86.03 0 top
R23  21.23,82.98 0 top
R24  21.23,87.55 180 top
R25  21.23,84.51 180 top
R26  40.39,66.7 0 top
R27  40.39,65.18 180 top
R28  17.4,83.72 270 top
R29  18.92,83.72 270 top
R30  37.36,63.35 0 top
R31  44.4,66.04 90 top
R32  44.4,62.99 270 top
R33  21.87,25.02 270 top
R34  21.87,29.41 270 top
R35  41.83,52.12 0 top
R36  38.81,52.12 0 top
R37  10.74,72.97 270 top
RN1  17.37,72.82 180 top
RN2  35.66,95.3 90 top
RN3  25.86,77.34 270 top
RN4  41.22,71.3 270 top
S1  48.18,84.66 90 top
S2  48.18,74.85 90 top
S3  48.18,65.05 90 top
TP1  20.78,74.47 0 top
TP2  41.1,98.68 0 top
TP3  41.1,96.14 0 top
U1  2.13,75.87 0 top
U2  16.46,77.98 0 top
U3  36.27,82.17 270 top
U4  22.58,77.42 0 top
U5  39.32,57.66 90 top
U6  44.02,48.39 270 top
U$1  19.25,44.55 0 top
U$2  -1.32,-4.32 0 top  (outside the outline)
U$3  4.78,58.67 0 top

### Tracks (layer width: path | path; a pad name or v marks a point on that pad's centre or on a via)
+3.3V  (via drill 0.3)
  Top 0.152: 13.61,95.11 C13.2 | 27.64,96.29 27.64,97.99 26.75,98.88 23.27,98.88 22.89,98.5 17.48,98.5 | U4.9 14.78,98.5 17.48,98.5 | R10.1 16.68,95.85 17.48,96.65 17.48,98.5 | 27.38,99.62 27.36,99.67 22.94,99.67 22.89,99.62 | 30.02,98.1 30.45,98.53 33.05,98.53 33.76,97.82 33.76,96.52 | 33.76,96.52 33.76,95.1 v33.35,94.69 | v33.35,93.55 39.68,93.55 45.92,87.3 45.92,71.48 45.29,70.84 45.29,67.13 44.98,66.83 44.42,66.83 R31.2 | RN3.1 25.75,78.54 25.86,78.44 25.86,77.75 | RN3.2 25.85,77.74 25.86,77.75 | 25.86,77.75 25.86,75.95 26.16,75.64 29.97,75.64 31.09,74.52 R16.2 | RN2.5 33.78,96.5 33.76,96.52 | v14.33,48.36 14.73,47.96 14.73,43.87 15.42,43.18 18.95,43.18 21.84,40.31 v21.84,39.29 | v21.92,34.52 21.92,32.77 20.63,31.47 20.63,27.41 20.04,26.82 v17.75,26.82 | v14.83,26.82 13.64,26.82 12,25.18 R15.2
  Top 0.203: C4.2 v12.9,76.78 13.1,76.98 U2.6
  Top 0.254: JP2.4 12.4,91.92 13.61,93.14 21.79,93.14 24.94,96.29 25.73,96.29 | 13.61,95.11 13.61,97.33 U4.9 | 25.73,96.29 27.64,96.29 29.41,96.29 30.02,96.9 30.02,98.1 28.67,99.47 28.52,99.62 27.38,99.62 | v13.67,60.33 13.69,60.33 13.92,60.17 26.59,60.17 27.03,60.6 v27.56,60.6 | R5.2 13.11,73.48 12.75,73.84 12.47,73.84 v12.24,74.07 | 22.89,99.62 22.53,99.26 12.55,99.26 9.12,95.83 9.12,81.23 10.69,79.65 12.52,79.65 v12.7,79.48 | v29.39,60.07 30.1,60.78 30.1,65.91 | 30.1,65.91 30.1,72.87 30.45,73.23 R16.2 | R19.1 30.25,65.94 30.1,65.91 | R13.2 25.74,96.28 25.73,96.29
  Top 0.305: R5.2 13.6,71.18 10.49,68.07 10.49,64.87 13.67,61.7 v13.67,60.33 | JP1.1 13.23,56.97 U4.1
  Bottom 0.152: v33.35,94.69 v33.35,93.55 33.35,93.4 | JP1.1 13.23,51.08 14.5,49.81 14.5,48.54 v14.33,48.36 | v21.84,39.29 21.59,39.04 21.59,34.85 v21.92,34.52 | v17.75,26.82 v14.83,26.82
  Bottom 0.203: v12.24,74.07 12.62,74.45 12.62,76.51 v12.9,76.78 14.66,76.78 14.81,76.94 14.81,78.23 14.55,78.49 13.49,78.49 12.7,79.3 v12.7,79.48
  Bottom 0.254: v29.39,60.07 28.63,60.07 28.09,60.6 v27.56,60.6
  Bottom 0.305: U4.1 13.67,57.46 13.82,57.61 13.82,60.17 v13.67,60.33
+5V  (via drill 0.3)  (1 unrouted)
  Top 0.203: C3.2 12.98,75.77 v13.29,76.08 v13.29,76.07 13.87,76.07 14.06,76.26 U2.7 | K1.1 24.64,17.83 24.97,18.16 24.97,19.81 25.35,20.19 D8.3 27.25,20.19 27.64,20.57 27.64,30.23 27.2,30.66 D9.3 26.17,29.98 24.87,28.68 24.87,26.95 24.51,26.59 23.24,26.59 22.81,27.03 22.81,31.95 23.6,32.74 23.6,35.69 v23.47,35.81 | R30.2 38.16,64.02 38.38,64.24 40.11,64.24 40.39,64.52 40.39,66.68 | 40.39,66.68 40.39,68.02 40.59,68.22 C24.2 | R26.2 40.41,66.7 40.39,66.68 | 10.69,43.31 11.2,42.8 18.8,42.8 21.21,40.39 21.21,39.01 21.56,38.66 23.88,38.66 24.64,39.42 K2.1 | 13.69,76.08 13.69,76.07
  Top 0.254: C24.2 41.22,68.26 C34.2 | 10.69,43.31 10.69,57.63 12.75,59.69 13.03,59.69 | 13.03,59.69 27.03,59.69 v27.23,59.87 | v12.52,73.18 13.11,72.59 13.11,71.37 10.01,68.28 10.01,64.67 13.03,61.65 13.03,59.69 | C42.2 34.2,58.28 34.29,58.29 38.91,58.29 38.96,58.24
  Top 0.305: R30.2 38.16,62.5 38.61,62.05 v38.96,62.05 | v38.96,60.86 38.96,58.24 38.96,57.68 40.26,56.39 U5.3 43.23,56.39 43.65,55.97 C33.2 | C14.2 25.82,81.95 26.62,81.15 28.96,81.15 32.03,78.08 R12.2 32.83,77.13 35.92,74.02 35.92,69.75 34.47,68.3 34.47,59.82 34.09,59.44 C42.2 32.96,58.35 32.39,58.93 v28.93,58.93
  Top 0.61: D4.K 25.81,83.02 C14.2
  Bottom 0.203: v13.29,76.08 13.03,75.82 13.03,73.76 12.52,73.25 v12.52,73.18 | v23.47,35.81 23.47,37.19 24.64,38.38 K2.1
  Bottom 0.305: v38.96,62.05 v38.96,60.86 | v28.93,58.93 28.19,59.64 27.97,59.87 v27.23,59.87
BATT_0+  (via drill 0.3)
  Top 0.152: D7.3 31.83,62.74 v32.13,63.04 | v33.35,63.02 33.38,63.09 33.38,65.18 33.93,65.74 33.93,71.58 34.75,72.39 34.75,72.9 34.29,73.36 34.29,74.02 30.33,77.98 28.88,77.98 28.52,78.33 28.52,78.94 27.76,79.71 25.02,79.71 23.11,81.61 23.11,85.65 22.73,86.03 R22.2
  Top 0.61: C19.1 11.76,26.67 11.99,26.9 D12.A
  Top 0.889: D12.A 11.99,34.78 | J6.1 11.78,34.78 11.99,34.78 | 11.99,34.78 14.46,34.78 K2.8
  Bottom 0.152: J6.1 3.73,42.78 3.71,42.8 3.71,64.97 5.66,66.93 30.53,66.93 31.32,66.14 31.32,63.58 31.85,63.04 v32.13,63.04 32.16,63.02 v33.35,63.02
BATT_0-  (via drill 0.3)
  Top 0.152: v31.93,63.83 31.22,63.12 31.22,60.19 R20.1
  Top 0.813: R21.2 8.64,32.88 6.38,35.14 J6.2
  Bottom 0.152: J6.2 3.4,38.11 3.35,38.16 3.35,65.13 5.51,67.29 30.68,67.29 31.93,66.04 v31.93,63.83 31.93,64.19
BATT_1+  (via drill 0.3)
  Top 0.152: D6.3 31.78,70.16 v31.95,70.33 | v34.16,72.64 33.93,72.87 33.93,73.86 30.18,77.62 28.7,77.62 28.17,78.16 28.17,78.79 27.61,79.35 24.87,79.35 22.76,81.48 22.76,82.83 22.61,82.98 R23.2
  Top 0.61: C18.1 11.94,16.08 12.01,16.38
  Top 0.889: K1.5 12.01,16.26 | 12.01,16.26 12.01,16.38 12.01,21.93 D13.A | J3.1 8.1,7.51 12.01,11.43 12.01,16.26
  Bottom 0.152: J3.1 3.26,7.51 1.58,9.2 1.58,65.89 4.75,69.06 30.3,69.06 31.57,70.33 v31.95,70.33 32.54,70.33 34.16,71.96 v34.16,72.64
BATT_1-  (via drill 0.3)
  Top 0.152: v31.88,71.15 31.17,70.43 31.17,67.48 R17.1
  Top 0.61: J3.2 3.56,4.02 3.56,8.69 6.6,11.61 6.93,11.61 R18.2
  Bottom 0.152: J3.2 1.22,6.38 1.22,66.04 4.6,69.42 30.15,69.42 v31.88,71.15
BUTTON
  Top 0.152: 35.64,94.87 35.64,94.11 35.63,94.1 RN2.8 32.84,94.11 31.47,92.74 13.97,92.74 13.56,92.33 13.56,82.4 13.77,82.19 15.93,82.19 | 35.64,94.87 35.64,95.63 | 35.64,95.63 35.64,96.52 | 35.64,96.52 35.64,97.66 35.48,97.82 R4.1 34.84,98.51 35,98.68 TP2.TP | RN2.7 35.6,94.9 35.64,94.87 | RN2.6 35.57,95.7 35.64,95.63 | RN2.4 35.66,96.5 35.64,96.52 | U2.24 16.96,81.29 16.05,82.19 15.93,82.19 | C7.2 15.94,82.21 15.93,82.19
C2CK  (via drill 0.3)
  Top 0.152: JP1.3 12.19,47.68 12.19,49.99 12.65,50.44 14,50.44 14.38,50.83 14.38,56.34 v14.45,56.41 | v14.33,60.81 14.33,61.65 10.92,65.05 10.92,67.89 14.05,71.02 14.05,72.62 14.5,73.07 R5.1 15.46,74.45 U2.9
  Bottom 0.152: v14.45,56.41 14.45,56.67 14.78,57 14.78,60.35 v14.33,60.81
C2D  (via drill 0.3)
  Top 0.152: JP1.2 14.73,50.65 14.73,55.86 15.27,56.39 v15.27,56.62 | v15.14,60.81 15.14,61.34 11.28,65.2 11.28,67.74 14.4,70.87 14.4,72.37 15.09,73.05 15.09,73.56 15.96,74.43 U2.10
  Bottom 0.152: v15.27,56.62 15.14,56.74 v15.14,60.81 15.14,60.83
CHRG_0  (via drill 0.3)
  Top 0.152: R34.1 21.87,31.6 22.91,32.64 v22.91,35.2 | v20.45,56.52 20.45,56.44 19.84,55.83 15.82,55.83 15.44,55.45 15.44,44.17 15.72,43.89 19.25,43.89 23.47,39.68 v23.47,39.27 | v20.55,60.81 20.55,61.16 20.98,61.6 22.86,61.6 23.19,61.93 23.19,73.53 20.37,76.35 20.37,76.71 19.6,77.48 U2.17
  Bottom 0.152: v20.45,56.52 20.22,56.74 20.22,60.43 20.55,60.76 v20.55,60.81 | v22.91,35.2 22.91,35.64 22.76,35.79 22.76,38.53 23.47,39.24 v23.47,39.27
CHRG_1  (via drill 0.3)
  Top 0.152: v19.63,56.52 19.63,56.49 19.38,56.19 15.67,56.19 15.09,55.6 15.09,44.02 15.57,43.54 19.1,43.54 22.66,39.98 v22.66,39.27 | v19.71,60.81 20.83,61.95 22.71,61.95 22.83,62.08 22.83,73.38 20.02,76.2 20.02,76.56 19.59,76.98 U2.16 | v22.17,35.54 22.17,35.1 22.56,34.72 22.56,32.82 21.03,31.29 21.03,27.53 21.87,26.7 R33.1
  Bottom 0.152: v19.63,56.52 19.86,56.74 19.86,60.55 v19.71,60.81 | v22.17,35.54 22.17,38.79 v22.66,39.27
D+
  Top 0.203: U1.D+ 5.99,75.87 6.2,75.67 6.2,74.73 6.43,74.5 6.83,74.5 7.06,74.73 R3.1
D-
  Top 0.203: U1.D- 8.34,76.52 8.59,76.28 R1.1
D/!C  (1 unrouted)
  Top 0.152: U2.27 15.46,80.99 15.34,81.13 11.3,81.13 10.59,81.84 10.59,93.19 10.95,93.55 21.62,93.55 23.85,95.78 U4.13
GATEDRV0
  Top 0.254: 46.54,26.44 Q7.G2 46.91,26.39 48.18,27.66 48.18,46 47.7,46.48 U6.5
GATEDRV1  (via drill 0.3 pad 0.3)
  Top 0.254: Q7.G1 43.25,24.45 v43,24.26 | v48.01,24.46 49.23,25.68 49.23,47.93 48.13,49.02 U6.7
  Bottom 0.254: v43,24.26 43.26,24.46 v48.01,24.46
GND  (via drill 0.3, 0.51)
  Top 0.203: U2.PAD 15.96,78.48 U2.3 12.96,78.48 12.88,78.56
  Top 0.305: Q7.S2 47.38,25.75 v47.52,25.93 | Q7.S1 42.99,25.11 v42.9,25.2 | U1.GND 5.69,74.57 6.12,74.14 6.12,73.74
  Top 0.406: 41.22,10.16 41.25,10.14 | 41.5,39.01 44.76,39.01 | 41.43,10.72 44.68,10.72 | 41.35,13.18 44.6,13.18 | 43,9.45 43,14.88 | 41.4,37.8 44.65,37.8 | 41.4,40.26 44.65,40.26 | 43.08,36.27 43.08,41.48 | U1.GND 5.05,73.89 | 40.95,8.18 44.2,8.18 | 41.02,42.8 44.27,42.8
  Top 0.508: 5.11,48.36 5.11,43.92 | 5.08,46.41 6.63,46.41 | R18.1 7.22,14.51 7.19,14.48 | R18.1 10.34,14.51 10.36,14.48 | R18.1 8.76,13.13 8.71,13.08 | R21.1 10.06,28.37 10.11,28.32 | R21.1 7.39,28.37 7.32,28.45 | R21.1 8.64,29.77 8.71,29.85
  Top 0.61: 7.72,67.39 7.72,62.94 | 5.46,65.15 7.7,65.15 | 10.74,58.62 10.74,62.48 | 12.4,60.35 8.53,60.35 | v30.81,5.21 C8.- v33.86,7.11 v33.86,3.3 | v32.03,14.48 34.87,14.48 | 32.03,36.32 34.87,36.32
  Top 0.813: C1.1 v17.35,62
  Bottom 0.508: 5.05,46.41 6.6,46.41
  Bottom 0.61: 9.8,65.18 5.49,65.15 | 7.72,65.15 7.72,63.17 | 10.74,62.41 10.77,58.09
  other vias: 34.77,14.48 34.82,36.35 32.03,36.35 41.07,42.77 44.83,39.01 43.08,36.04 41.3,39.01 43.87,42.8 41.25,11.94 44.75,11.94 41.07,8.15 43,14.83 43.89,8.15 28.98,20.52 30.96,30.33 28.98,30.3 30.96,20.52 32.99,20.52 32.84,30.33 8.76,13.06 7.37,80.06 14.81,74.63 10.08,76.3 23.7,25.3 8.64,29.79 6.27,73.56 11.15,71.04 20.4,7.11 26.87,66.22 26.75,70.16 24.46,70.16 24.41,66.22 5.94,70.38 1.09,67.16 48.23,47.7 42.72,47.65 47.29,44.91 38.46,56.41 44.25,52.63 42.67,65.53 14.33,87.2 11.99,66.22 9.68,53.39 13.33,37.34 9.63,50.37 12.19,78.66 7.85,71.65 15.77,66.22 15.16,70.97 18.44,70.94 18.77,75.67 19.66,73.99 23.85,77.17 36.75,62.31 28.42,73.18 26.82,74.93 22.07,66.22 3.81,79.2 29.62,74.8 4.19,39.67 43.54,70.1 37.19,69.22 5.13,80.87 34.09,55.25 41.81,89.41 36.27,82.17 42.82,82.52 44.35,75.34 38.2,76.3 38.35,82.19 21.21,88.72 34.06,84.02 23.83,93.9 30.05,99.24 23.98,78.79 27.18,91.31 34.26,90.2 30.81,87.25 40.77,81.23 2.29,6.81 6.48,19.13 6.48,24.33 4.06,34.87 6.15,78.23 28.98,83.01 27.25,84.46 33.78,81.61 38.05,80.26 28.93,79.83
  pour Top (isolate 0.203, rank 2): 49.99,0 0,0 0,100 49.99,100
  pour Bottom (isolate 0.203, rank 2): 49.99,0 0,0 0,100 49.99,100
GPIO0  (via drill 0.3)
  Top 0.152: RN1.8 19.62,72.02 20.83,73.23 v22.17,73.23 | v23.83,73.13 23.83,73.2 24.18,73.56 26.9,73.56 v27.13,73.33
  Bottom 0.152: v22.17,73.23 23.72,73.23 v23.83,73.13 | v27.13,73.33 27.13,74.17 27.48,74.5 28.6,74.5 29.41,73.69 34.14,73.69 34.65,74.19 35.13,74.19 35.51,73.79 35.48,71.76 31.72,68 5.21,68 2.64,65.43 2.64,34.39 5.16,31.88 5.16,19.81 J4.2
GPIO1  (via drill 0.3)
  Top 0.152: RN1.6 16.97,72.5 17.32,72.85 19.91,72.85 20.88,73.81 v21.56,73.81 | v27.71,73.91 v23.65,73.91
  Bottom 0.152: v21.56,73.81 21.67,73.91 v23.65,73.91 | v27.71,73.91 28.68,73.91 29.26,73.33 34.32,73.33 34.75,72.9 34.75,72.03 31.42,68.71 4.9,68.71 1.93,65.74 1.93,34.09 4.45,31.57 4.45,29.26 J5.2
GPIO2
  Top 0.152: U2.15 19.51,76.48 19.66,76.33 19.66,76.05 20.78,74.93 TP1.TP
IBAT0
  Top 0.152: U2.19 21.18,78.48 C20.1 21.84,78.41 22.05,78.21 22.05,76.28 22.23,76.1 23.65,76.1 24.49,76.94 RN3.3
IBAT1
  Top 0.152: U2.18 19.61,77.98 20.65,76.94 21.22,76.94 C22.1 21.25,76.26 21.77,75.74 23.8,75.74 24.2,76.14 RN3.4
LOAD  (via drill 0.3)
  Top 0.813: 18.26,41.83 18.24,41.86
  Top 0.889: K1.3 19.56,17.96 19.05,18.47 18.49,18.47 16.82,20.14 16.82,30.63 19.56,33.38 K2.10 | v18.26,41.76 18.26,41.83 | 18.24,41.86 10.77,41.86 9.73,42.9 9.73,46.77 J7.1
  Bottom 0.813: 18.26,38.66 v18.26,41.76
  Bottom 0.889: K2.10 19.56,37.36 18.26,38.66
MISO
  Top 0.152: R11.1 10.63,94.43 9.88,93.68 9.88,81.56 11.02,80.42 13.69,80.42 14.06,80.05 U2.1
MOSI  (1 unrouted)
  Top 0.152: U2.28 14.69,80.38 14.3,80.77 11.15,80.77 10.24,81.69 10.24,93.45 10.69,93.9 21.46,93.9 22.61,95.05 22.61,97.64 23.42,98.45 25.35,98.45 U4.14
N$1
  Top 0.203: Q2.1 36.44,8.08 37.61,6.92 R6.1 C6.2 37.61,2.98 37.8,2.79 37.8,2.14 Q1.3
N$2  (1 unrouted)
  Top 0.152: R11.2 12.23,94.45 12.4,94.29 18.29,94.29 | 18.29,94.29 21.06,94.29 21.29,94.51 21.29,95.06 C10.2 21.31,95.09 U4.12 | R10.2 18.25,94.37 18.29,94.29
N$3  (via drill 0.33)
  Top 0.203: Q5.3 D8.1 22.87,21.14 22.68,20.96 22.68,19.05 23.52,18.21 v23.52,15.32
  Bottom 0.203: K1.12 24.64,14.2 v23.52,15.32
N$4  (via drill 0.33)
  Top 0.889: D13.K v18.99,19.73
  Bottom 0.889: v18.99,19.73 18.29,19.03 18.29,15.06 19.53,13.82 K1.10
N$5
  Top 0.203: Q6.3 23.87,28.26 25.04,29.44 25.04,31.67 | D9.1 24.98,31.61 25.04,31.67 | 25.04,31.67 25.04,32.69 24.64,33.1 K2.12
N$6
  Top 0.152: R32.1 45.07,63.79 45.59,63.27 45.59,59.36 45,58.76 C28.2
  Top 0.203: U5.5 43.38,58.93 43.55,58.76 C28.2 44.43,58.71 | R31.1 R32.1
N$7
  Top 0.152: Q1.1 39.18,1.13 38.81,0.76 20.14,0.76 19.55,1.36 R7.2
N$8
  Top 0.152: Q6.1 24.73,26.28 24.64,26.19 22.99,26.19 21.87,27.31 R34.2
N$9
  Top 0.152: R33.2 21.5,24.22 21.51,24.23 25.22,24.23 26.17,23.29 Q5.1
N$10  (via drill 0.33)
  Top 0.889: D12.K 19,31.14 20.85,33 v20.85,35.64
  Bottom 0.889: v20.85,35.64 20.85,39.7 20.68,39.88 K2.3
N$11
  Top 0.152: C30.2 39.37,70.9 RN4.3 41.01,70.9 41.22,70.69 41.22,70.31 41.43,70.1 RN4.5
N$12  (1 unrouted)
  Top 0.254: R13.1 28.96,94.89 U4.16
N$13
  Top 0.152: C26.2 15.9,84.51 15.91,84.52 R28.1 R28.1 arc-45 17.42,84.58 17.42,91.19 18.26,92.02 40.21,92.02 45.21,87.02 45.21,71.81 44.65,71.25 43.1,71.25 42.65,71.7 RN4.7
N$14
  Top 0.152: R29.1 18.92,84.02 18.62,83.72 15.29,83.72 15.14,83.87 15.14,85.95 15.24,86.06 C27.2 16.64,86.06 17.04,86.46 17.04,91.34 18.09,92.38 40.36,92.38 45.57,87.17 45.57,71.65 44.81,70.9 RN4.6
N$15
  Top 0.152: C29.2 39.32,71.7 RN4.2 40.99,71.7 41.22,71.93 41.22,72.24 41.48,72.5 RN4.8
N$16
  Top 0.152: U2.14 17.96,74.85 18.57,74.24 RN1.1
N$17
  Top 0.61: J1.1 13.94,65.06 C1.2 20.87,65.06 21.41,64.52 21.41,63.94 D2.A
N$18  (1 unrouted)
  Top 0.254: 45.85,24.45 Q7.D1@1 46.5,23.68 | 45.85,24.45 45.3,24.45 45.14,24.28 | Q7.D1@2 45.95,25.1 45.85,24.94 45.85,24.45 | 45.85,24.45 45.85,23.65 | 45.14,24.29 45.14,23.65 | 44.49,24.55 44.49,23.79
  Top 0.61: 41.35,21.72 44.4,21.72 | 41.48,19.3 44.53,19.3
  pour Top (isolate 0.203): 40.84,25.15 42.37,25.15 47.6,25.17 47.6,15.39 43.66,15.39 40.92,18.14 40.92,22.02
N$19
  Top 0.203: Q3.1 39.83,78.75 R14.1 39.79,77.51 39.53,77.25 D5.3
N$20
  Top 0.305: D3.2 D3.1 41.45,82.61 41,83.06 41,89.89 40.59,90.3 37.16,90.3 36.53,89.66 35.89,89.66 35.64,89.41 35.64,87.23 L1.1
  Top 0.406: C11.1 33.29,83.12 U3.1 34.98,83.76 arc45 34.98,83.77 35.62,84.41 arc45 35.69,84.59 L1.1
N$22
  Top 0.152: R8.1 21.3,2.11 R7.1
  Top 0.305: R8.1 21.3,4.84 21.67,5.21
  Top 0.61: Q2.3 21.09,5.78 21.67,5.21 C8.+
N$23
  Top 0.406: 28.91,87.27 L2.2 28.89,84.37 30.25,83.01 C11.2
  Top 0.61: C11.2 31.28,82.95 | D4.A 25.81,88.21 26.47,87.55 28.58,87.55 L2.2
N$24
  Top 0.203: U2.4 13.34,77.98 13.31,77.95 11.38,77.95 10.54,78.79 7.87,78.79 7.06,77.98 R3.2
N$25
  Top 0.203: R14.2 38.19,79.39 38.43,79.63 43.72,79.63 43.75,79.65
  Top 0.305: C12.2 43.9,82.69 43.75,82.53 D3.3 43.75,79.65 Q3.3
N$26
  Top 0.152: R12.1 R9.2 34.43,80.33 34.62,80.52 34.87,80.52 34.98,80.63 U3.3
N$27
  Top 0.152: U2.8 13.58,75.58 13.11,75.12 C5.2 12.65,74.5 12.5,74.65 10.74,74.65 | 10.74,74.65 9.5,74.65 9.23,74.38 9.23,73.79 R2.2 | R37.1 10.74,74.65
N$28
  Top 0.203: U2.5 13.35,77.48 13.28,77.55 11.2,77.55 10.36,78.38 10.11,78.38 9.91,78.18 9.91,77.52 9.75,77.39 9.58,77.39 9.42,77.55 9.42,78.21 9.25,78.38 8.79,78.38 8.59,78.18 R1.2
N$29
  Top 0.152: U2.13 17.46,74.51 17.77,74.2 RN1.2
N$30
  Top 0.152: S1.2 48.18,86.56 39.5,95.25 38.18,95.25 37.41,96.01 37.41,97.54 37.14,97.82 R4.2
N$31
  Top 0.152: U2.12 16.96,73.64 RN1.3
N$32
  Top 0.152: RN1.4 16.17,74.09 16.46,74.37 U2.11
N$33
  Top 0.305: J2.2 7.34,19.79 7.34,21.62 7.85,22.12 C17.1
  Bottom 0.305: J5.1 2.01,29.36 2.01,21.95 J4.1 2.01,19.2 2.01,15.22 2.95,14.28 3.76,14.28 8.03,18.54 J2.2
N$34
  Top 0.152: S2.2 48.18,72.14 47.04,73.28 47.04,87.2 39.34,94.9 37.16,94.9 | RN2.2 37.16,94.9 | RN2.3 37.09,95.7 37.16,95.63 37.16,94.9
N$35
  Top 0.305: R15.1 9.37,21.87 J2.1
N$39
  Top 0.152: S3.2 48.18,66.95 47.07,68.07 47.07,72.75 46.69,73.13 46.69,87.05 39.63,94.1 RN2.1
N$56
  Top 0.203: C24.1 39.62,68.19 | R27.2 R26.1 C24.1 | C24.1 38.91,68.22 38.62,67.93 Q4.1
N$57
  Top 0.152: R30.1 36.56,66.64 36.21,66.99 Q4.2
N$60
  Top 0.152: 40.34,61.47 40.34,59.56 | 40.34,59.56 40.34,57.96 40.64,57.66 U5.4 43.99,57.66 45.14,56.52 45.14,55.37 44.88,55.12 U5.2 | 40.34,61.47 39.57,61.47 | 38.3,61.47 39.57,61.47 | Q4.3 37.16,64.64 37.36,64.44 37.36,62.66 38.3,61.72 38.3,61.47 | 39.57,61.47 39.57,63.34 C25.2 | 38.3,61.47 38.3,60.45 38.05,60.2 U5.9 | 40.34,61.47 U5.7 | 40.34,59.56 44.15,59.56 44.37,59.79 C28.1
N$61
  Top 0.152: 45.14,26.24 45.14,26.44 45.07,26.51
  Top 0.254: Q7.D2@1 43.39,25.75 43.08,26.06 42.9,26.34 43,26.34 43.08,26.42 43.74,26.42 43.77,26.42 Q7.D2@2
  Top 0.305: Q7.D2@2 44.97,26.41 45.07,26.51 45.09,26.19 | 45.77,27.08 45.77,26.31 | 44.5,27.08 44.5,26.31 | 45.14,27.25 45.14,26.24 | 43.74,27.18 43.74,26.42
  Top 0.61: 41.48,31.75 44.65,31.75 | 41.48,29.34 44.65,29.34
  pour Top (isolate 0.203): 42.52,25.63 43.31,25.65 43.43,25.55 46.02,25.55 46.02,26.14 47.32,27.43 47.29,35.56 43.71,35.56 40.92,32.77 40.92,25.63
N$63
  Top 0.813: 39.42,20.38 L3.4 39.53,24.2 39.37,24.36 C38.1
  Top 1.422: D11.A 33.94,24.02 37.54,20.42 39.52,20.42 L3.4
N$64
  Top 0.813: C36.1 38.33,26.65 39.17,26.65 39.57,27.05 L4.3 39.57,30.51
  Top 1.422: D10.A 33.99,26.83 37.62,30.46 39.56,30.48 L4.3
N$67
  Top 0.305: 39.55,38.43 39.55,38.97 L4.2
  Top 0.813: C37.2 L4.2
  Top 0.889: K2.4 17.02,38.35 17.48,37.9 29.77,37.9 30.3,38.43 39.55,38.43
N$68
  Top 0.889: D10.K 30.56,34.26 C40.2 29.46,36.35 29.03,36.78 17.42,36.78 17.02,36.37 K2.9
N$69
  Top 0.813: C41.2 30.53,16.06 D11.K
  Top 0.889: K1.4 17.02,14.83 17.55,14.3 29.08,14.3 29.26,14.48 C41.2
N$70
  Top 0.305: L3.1 39.53,12.42 39.47,12.47
  Top 0.813: C39.2 39.57,11.88 L3.1
  Top 0.889: K1.9 17.02,12.73 17.53,13.18 29.11,13.18 29.82,12.47 39.47,12.47
N$100
  Top 0.152: R17.2 32.73,67.52 D6.1 R16.1 32.69,74.07 30.61,76.14 RN3.5
N$101
  Top 0.152: R20.2 32.78,60.2 D7.1 R19.2 33.38,65.94 33.58,66.14 33.58,73.71 30.35,76.94 RN3.6
PWM0
  Top 0.152: U2.23 17.46,82.88 R28.2
PWM0_OUT
  Top 0.152: U5.1 41.92,53.26 42.06,53.11 42.42,53.11 42.63,52.9 R35.2 42.65,52.11 42.65,49.45 42.19,49 42.16,49.02 U6.2
PWM0_REF
  Top 0.152: RN4.1 39.53,72.5 C31.2 39.24,73.26 39.07,73.43 37.85,73.43 37.64,73.23 37.64,70.71 35,68.07 35,61.95 35.48,61.47 U5.8
PWM1
  Top 0.152: U2.22 17.96,81.26 18.92,82.22 R29.2
PWM1_OUT
  Top 0.152: 38.81,52.15 38.81,51.51 39.83,50.5 39.83,46.94 40.28,46.48 U6.4 | 38.81,52.15 38.81,53.47 38.41,53.87 36.74,53.87 U5.14 | R36.1 38.79,52.12 38.81,52.15
PWM1_REF
  Top 0.152: C32.2 39.59,70.1 RN4.4 40.42,69.74 40.87,69.29 43.23,69.29 43.51,69.01 43.51,63.25 43.74,63.02 44.98,63.02 45.21,62.79 45.21,61.54 44.91,61.24 43.66,61.24 43.49,61.06 43.49,60.45 43.38,60.35 43.38,60.33 43.26,60.2 U5.6
RXD0
  Top 0.152: U2.25 16.46,81.18 15.8,81.84 11.61,81.84 11.3,82.14 11.3,85.4 11.51,85.6 JP2.2
SCK  (1 unrouted)
  Top 0.152: U2.2 13.43,78.98 13.31,79.1 13.31,79.76 13.01,80.06 10.87,80.06 9.53,81.41 9.55,95.68 12.73,98.86 22.71,98.86 23.14,99.29 27.05,99.29 U4.15
THEM0  (via drill 0.3)
  Top 0.152: RN1.7 17.77,71.29 17.53,71.04 v16.99,71.04 | v34.67,70.08 34.67,71.7 35.48,72.52 35.48,73.84 30.61,78.74 30.2,79.15 v29.69,79.15 | RN3.7 27.57,77.74 arc45 v27.58,77.75
  Bottom 0.152: v16.99,71.04 16.99,72.31 22.43,77.75 v27.58,77.75 27.81,77.98 29.39,77.98 29.72,78.33 29.72,79.12 v29.69,79.15 | v34.67,70.08 34.32,70.08 31.88,67.64 5.36,67.64 3,65.28 3,34.54 5.51,32.03 5.51,17.63 J4.3
THEM1  (via drill 0.3)
  Top 0.152: RN1.5 v16.17,71.05 v16.18,71.04 | RN3.8 27.57,78.54 v27.58,78.56 | v34.87,73.58 34.87,73.94 30.25,78.56 v29.13,78.56
  Bottom 0.152: 16.18,72.26 v16.18,71.04 16.18,72.01 22.28,78.11 27.13,78.11 v27.58,78.56 v29.13,78.56 | v34.87,73.58 35.13,73.38 35.13,71.91 31.57,68.35 5.05,68.35 2.29,65.58 2.29,34.24 4.8,31.73 4.8,27.08 J5.3
TXD0
  Top 0.152: U2.26 15.96,81.04 15.52,81.48 11.46,81.48 10.95,81.99 10.95,87.58 11.51,88.14 JP2.3
VBAT0
  Top 0.152: U2.21 19.48,79.48 19.71,79.71 19.71,81.43 | 19.71,81.43 19.71,85.85 19.89,86.03 R22.1 R24.2 | C21.1 19.74,81.46 19.71,81.43
VBAT1
  Top 0.152: U2.20 20.15,78.98 20.43,79.26 C23.1 21.03,79.93 21.21,80.11 21.21,82.83 21.06,82.98 R23.1 R25.2
VBUS  (via drill 0.3)
  Top 0.406: U1.VBUS1 5.05,79.16 v5.18,79.3
  Top 0.61: D1.A 20.07,70.74 v19.3,70 | C2.1 v5.18,79.3
  Bottom 0.61: v5.18,79.3 5.18,72.85 8.05,69.98 8.51,69.98 v19.3,70
VCC  (via drill 0.3)  (1 unrouted)
  Top 0.152: R8.2 20.12,3.84 20.35,3.61 20.35,1.47 20.7,1.12 38.56,1.12 39.52,2.08 39.73,2.08 40.04,2.4 Q1.2 40.04,4.29 39.78,4.55 C6.1 | R37.2 11.72,72.17 12.01,71.88 12.01,70.87 9.6,68.45 9.6,64.52 11.38,62.74 11.38,62.41 v11.61,62.18
  Top 0.305: v30.51,74.27 29.39,73.15 29.39,71.66 D1.K | U3.4 36.81,81.23 35.36,79.78 v35.36,75.51
  Top 0.406: Q2.2 19.46,3.89 R8.2 | U3.4 U3.5 C9.2 39.5,87.06 arc-45 L1.2
  Top 0.61: K1.8 14.48,9.35 15.74,8.08 Q2.2
  Top 0.762: 11.48,57.38 11.51,57.33
  Top 0.813: K1.8 14.48,13.77 15.75,15.04 15.75,36.93 14.45,38.25 14.45,39.88 K2.5 12.27,39.88 v11.51,40.64 | D1.K 28.47,67.46 D2.K | D2.K 28.47,59.82 27.61,58.95 v13.13,58.95 11.51,57.33 v11.51,43.56
  Bottom 0.152: v11.61,62.18 13.08,60.71 13.08,59 v13.13,58.95
  Bottom 0.305: v30.51,74.27 34.11,74.27 v35.36,75.51
  Bottom 0.813: v11.51,43.56 v11.51,40.64
VPP  (via drill 0.3)
  Top 0.152: R35.1 R36.2 39.61,51.4 40.21,50.8 40.21,48.59 40.41,48.39 43.97,48.39
  Top 0.305: v45.9,70.64 46.08,70.43 46.08,52.27 43.97,50.17 43.97,48.39 43.97,46.94 43.07,46.04 C35.2 | Q3.2 41.45,75.36 C15.2 41.47,74.64 41.81,74.3 43.41,74.3 44.2,73.51 44.2,72.34 v44.53,71.96
  Top 0.406: C35.2 C16.2 44.51,46.44 45.8,47.73 46.74,47.73 U6.6
  Bottom 0.305: v44.53,71.96 v45.9,70.64

### Text on the board
tPlace: +3.3V | TxD | RxD | GND | Ext. Load | C2 Debug | +3.3V | C2D | Battery Analyzer / Ver 2.1 "Raiden" / Copyright (c) 2015 / by K. C. Lee | C2CK | + / / - | GND | + | Ch0 | - | Ch1 | + / / / -
bPlace: 3.3V / Serial / /GPIO | + / Ext Load / - | + / Ch. 0 / - | C / h / 0 | +3.3V / / GPIO / / THERM / / GND | 3.3V / Enable | C / h / 1 | 3.3V / / GPIO / / THERM / / GND | + / Ch. 1 / -
tDocu: Creative Common / Attrib. Sharealike / Noncommercial